# EAGLE design ardumashtun_opl_v1 (EAGLE 6.5.0)
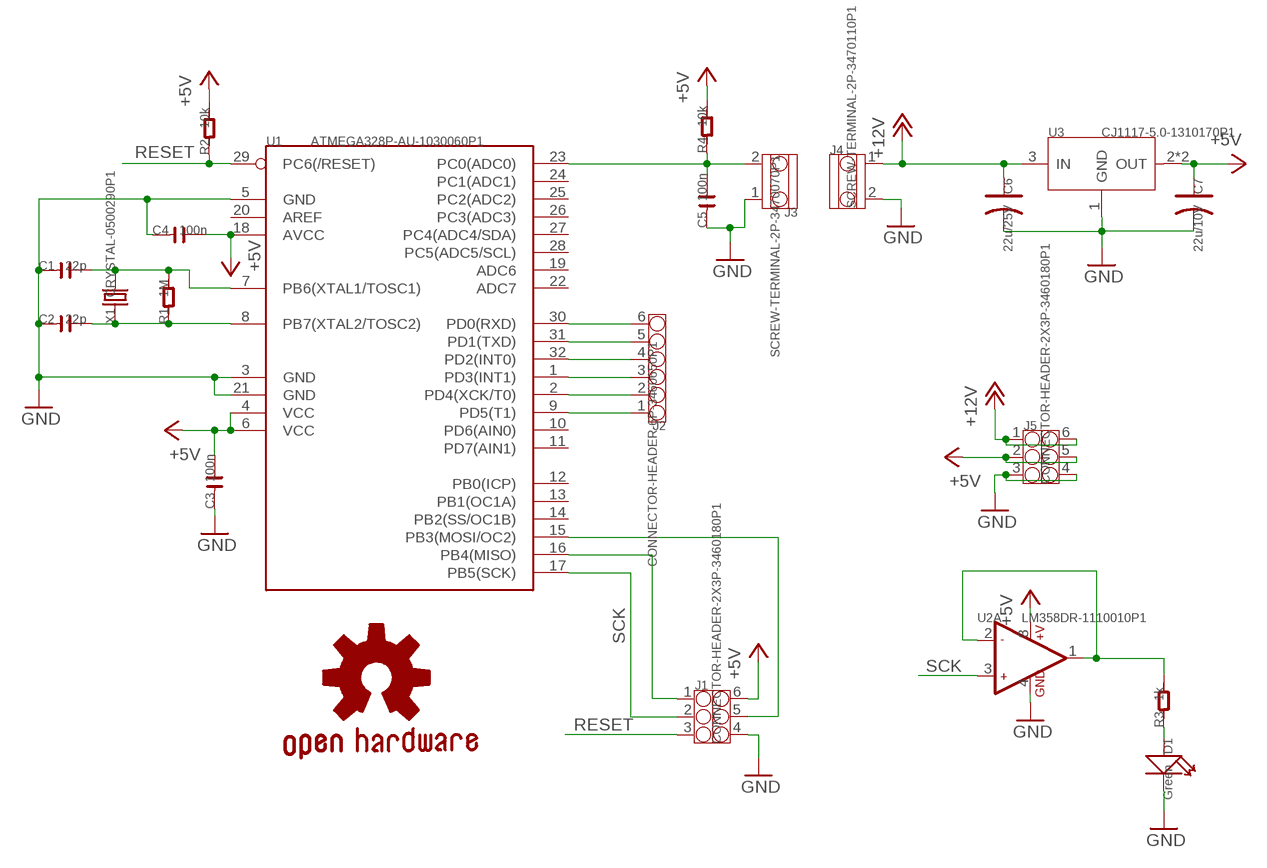
[diagram p0: schematic, sheet 1]

## Parts
C1  22p  C-0603  [C0603]
C2  22p  C-0603  [C0603]
C3  100n  C-0603  [C0603]
C4  100n  C-0603  [C0603]
C5  100n  C-0603  [C0603]
C6  22u/25V  C-POLAR-C  [AVX-C]
C7  22u/10V  C-POLAR-B  [AVX-B]
D1  Green  LED  [LED0603]
GOLD_ORB_SM1  OSHWLOGO_GOLD_ORB_SM  [OSHW2]
J1  CONNECTOR-HEADER-2X3P-3460180P1  [2X3P-2.54-2.54-11.6-3.0-BLACK-MALE]
J2  CONNECTOR-HEADER-6P-3460650P1  [1X6P-2.54-2.54-11.6-3.0-BLACK-MALE]
J3  SCREW-TERMINAL-2P-3470070P1  [2P-3.5]
J4  SCREW-TERMINAL-2P-3470110P1  [2P-5.0]
J5  CONNECTOR-HEADER-2X3P-3460180P1  [2X3P-2.54-2.54-11.6-3.0-BLACK-MALE]
R1  1M  R-0603  [R0603]
R2  10k  R-0603  [R0603]
R3  1k  R-0603  [R0603]
R4  10k  R-0603  [R0603]
U1  ATMEGA328P-AU-1030060P1  [TQFP32]
U2  LM358DR-1110010P1  [SOIC8]
U3  CJ1117-5.0-1310170P1  [SOT223]
X1  CRYSTAL-0500290P1  [2P-SMD-5.0X3.2]

## Nets
+5V: C3.2 C4.2 C7.+ J1.6 J5.2 J5.5 R2.2 R4.2 U1.4(VCC) U1.6(VCC) U1.18(AVCC) U2.8(A:+V) U3.2(OUT) U3.TER(OUT)
+12V: C6.+ J4.1 J5.1 J5.6 U3.3(IN)
GND: C1.1 C2.1 C3.1 C4.1 C5.1 C6.- C7.- D1.- J1.4 J3.1 J4.2 J5.3 J5.4 U1.3(GND) U1.5(GND) U1.21(GND) U2.4(A:GND) U3.1(GND)
N$1: C1.2 R1.2 U1.7(PB6(XTAL1/TOSC1)) X1.2
N$2: C2.2 R1.1 U1.8(PB7(XTAL2/TOSC2)) X1.1
N$3: R3.2 U2.1(A:OUT1) U2.2(A:-IN1)
N$5: J1.1 U1.16(PB4(MISO))
N$6: J1.5 U1.15(PB3(MOSI/OC2))
N$7: D1.+ R3.1
N$8: J2.6 U1.30(PD0(RXD))
N$9: J2.5 U1.31(PD1(TXD))
N$10: J2.4 U1.32(PD2(INT0))
N$11: J2.3 U1.1(PD3(INT1))
N$12: J2.2 U1.2(PD4(XCK/T0))
N$13: J2.1 U1.9(PD5(T1))
N$14: C5.2 J3.2 R4.1 U1.23(PC0(ADC0))
RESET: J1.3 R2.1 U1.29(PC6(/RESET))
SCK: J1.2 U1.17(PB5(SCK)) U2.3(A:+IN1)
Unconnected: U1.10(PD6(AIN0)) U1.11(PD7(AIN1)) U1.12(PB0(ICP)) U1.13(PB1(OC1A)) U1.14(PB2(SS/OC1B)) U1.19(ADC6) U1.20(AREF) U1.22(ADC7) U1.24(PC1(ADC1)) U1.25(PC2(ADC2)) U1.26(PC3(ADC3)) U1.27(PC4(ADC4/SDA)) U1.28(PC5(ADC5/SCL)) U2.5(B:+IN2) U2.6(B:-IN2) U2.7(B:OUT2)

## Library data of the parts
C1-C5 = OPL Eagle Library:C*
C6 C7 = OPL Eagle Library:C-POLAR*
D1 = OPL Eagle Library:LED*: LED
GOLD_ORB_SM1 = bfl:OSHWLOGO: These are Open-Source Hardware logos.
J1 J5 = OPL Eagle Library:CONNECTOR-HEADER-2X3P
J2 = OPL Eagle Library:CONNECTOR-HEADER-6P
J3 J4 = OPL Eagle Library:SCREW-TERMINAL-2P
R1-R4 = OPL Eagle Library:R*
U1 = OPL Eagle Library:ATMEGA328P-AU: 8-bit AVR Microcontroller with 32K Bytes In-System Programmable Flash
U2 = OPL Eagle Library:LM358DR: General purpose LOW Voltage, Rail-to-Rail Output Amplifiers http://www.fairchildsemi.com/ds/LM/LMV358.pdf
U3 = OPL Eagle Library:CJ1117-5.0
X1 = OPL Eagle Library:CRYSTAL*

## Board
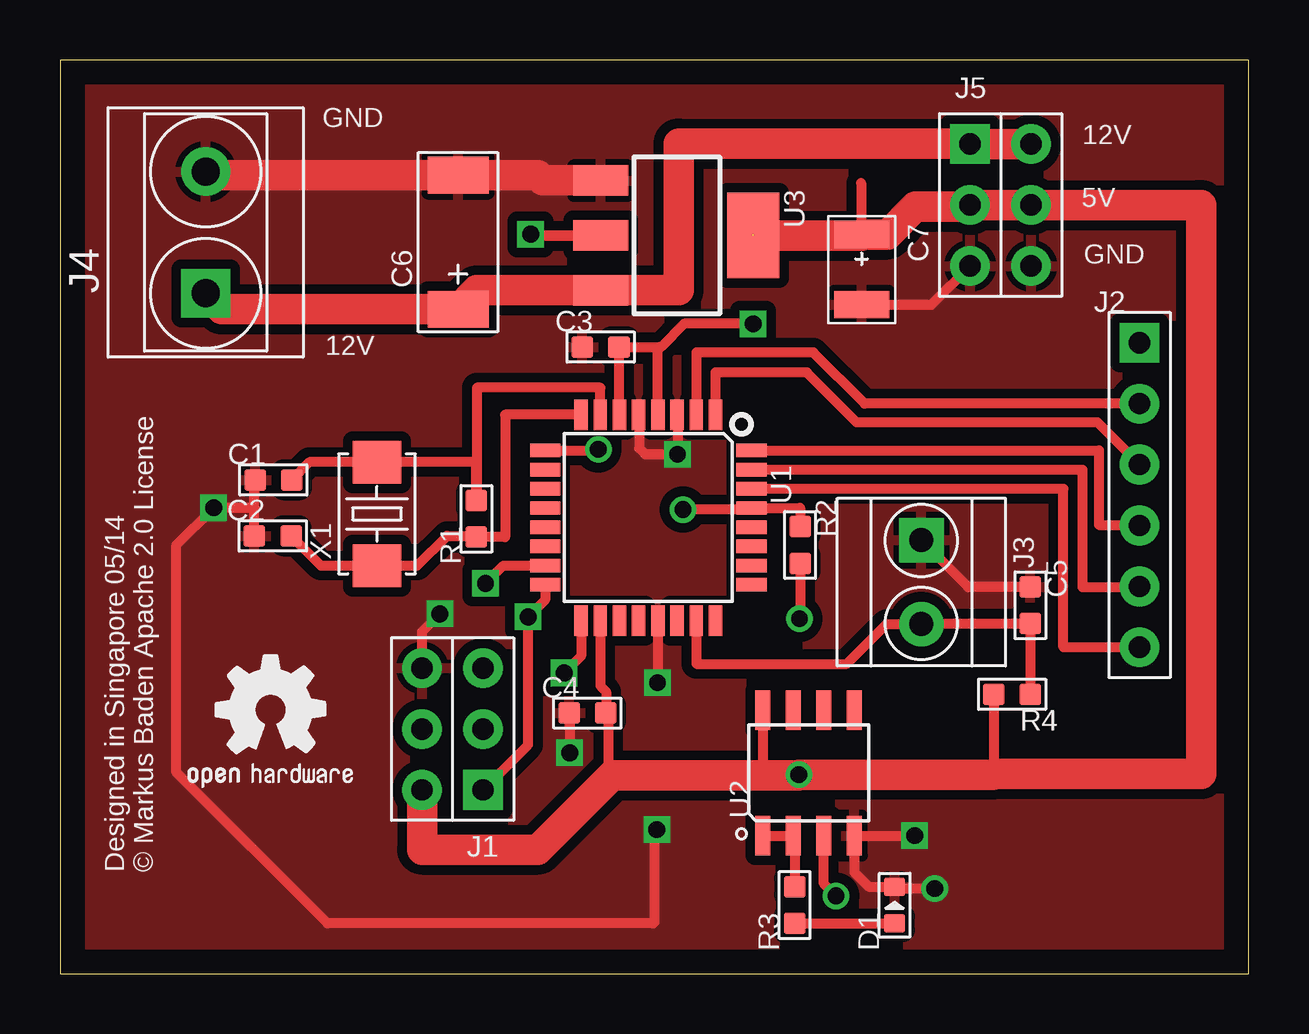
[diagram p1: board, top side]
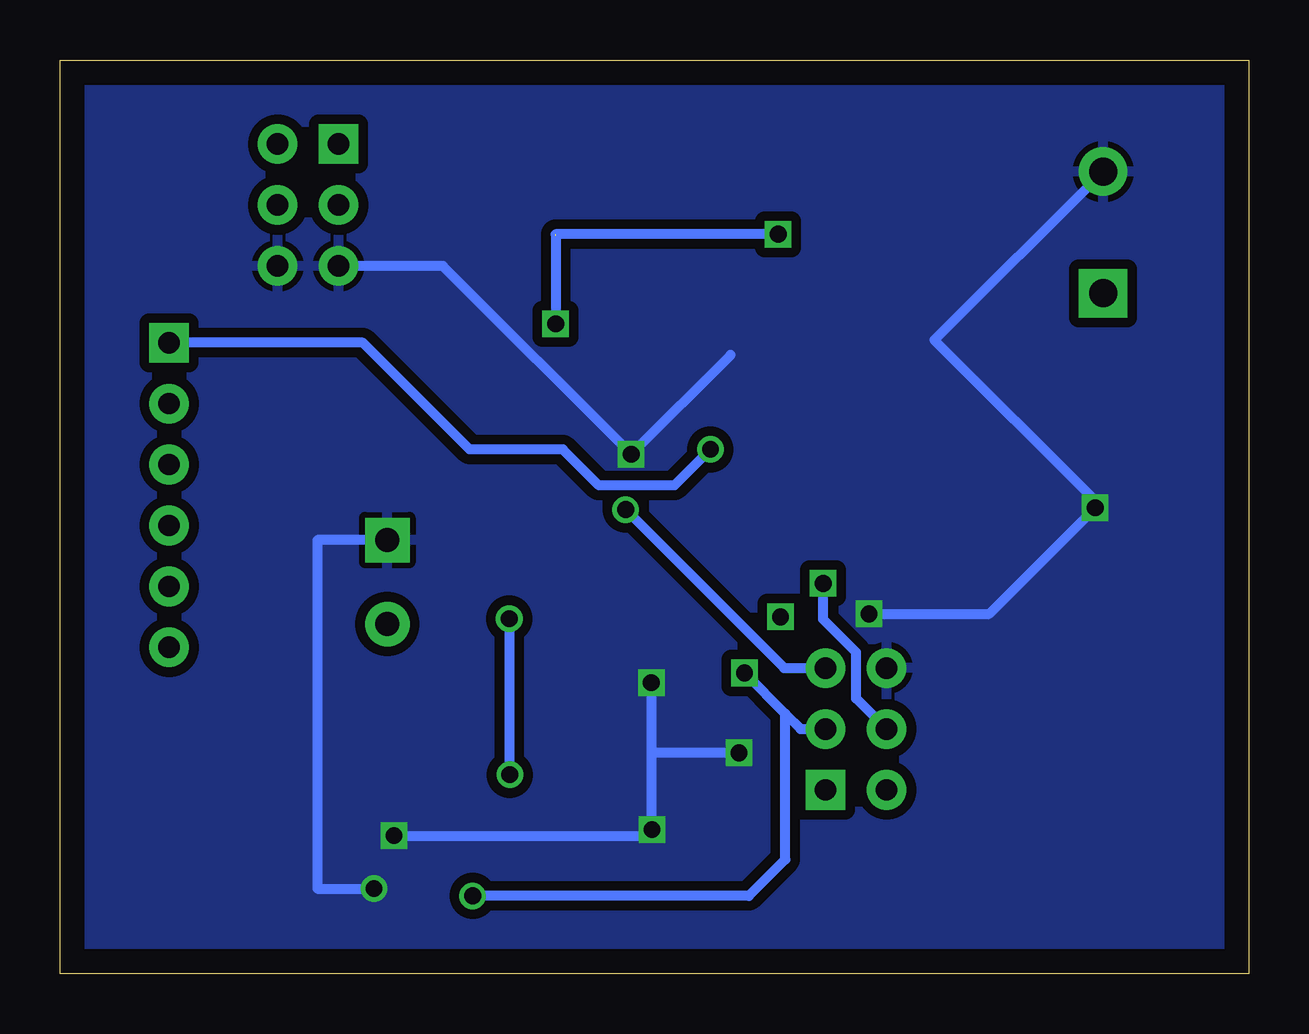
[diagram p2: board, bottom side, seen from below]

Size 49.53 x 38.1 mm. Coordinates in mm from the lower left corner, seen from the top.
Outline: 0,0 49.53,0 49.53,38.1 0,38.1 0,0
Copper layers (1*16): Top 0.035mm / dielectric 1.5mm / Bottom 0.035mm
Design rules "default": minimum track width 10mil, minimum drill 24mil, track to track 8mil, track to pad 8mil, pad to pad 8mil, via to via 8mil, smd to smd 8mil, copper to edge 40mil, drill to drill 8mil, minimum pad ring 10mil, minimum via ring 8mil, stop-mask expansion 4mil, vias tented up to drill 0mil, thermal gap 10mil

### Footprints (pad centres in the part's own frame; a part is rotated, then mirrored left to right if it is on the bottom)
C0603 = smd 0.889 x 0.889: 1 -0.762,0; 2 0.762,0
AVX-C = smd 1.524 x 2.54: + -2.794,0; - 2.794,0
AVX-B = smd 1.143 x 2.286: + -1.46,0; - 1.46,0
LED0603 = smd 0.762 x 0.889: + -0.762,0; - 0.762,0
2X3P-2.54-2.54-11.6-3.0-BLACK-MALE = drill 0.889 pad 1.651 square: 1 -1.27,2.54 | drill 0.889 pad 1.651: 2 -1.27,0; 3 -1.27,-2.54; 4 1.27,-2.54; 5 1.27,0; 6 1.27,2.54
1X6P-2.54-2.54-11.6-3.0-BLACK-MALE = drill 0.889 pad 1.651 square: 1 0,6.35 | drill 0.889 pad 1.651: 2 0,3.81; 3 0,1.27; 4 0,-1.27; 5 0,-3.81; 6 0,-6.35
2P-3.5 = drill 1 pad 1.85 square: 1 -1.75,0 | drill 1 pad 1.85: 2 1.75,0
2P-5.0 = drill 1.168 pad 2.032 square: 1 -2.54,0 | drill 1.168 pad 2.032: 2 2.54,0
R0603 = smd 0.889 x 0.889: 1 -0.762,0; 2 0.762,0
TQFP32 = smd 1.27 x 0.559: 1 -4.293,2.8; 2 -4.293,2; 3 -4.293,1.2; 4 -4.293,0.4; 5 -4.293,-0.4; 6 -4.293,-1.2; 7 -4.293,-2; 8 -4.293,-2.8; 17 4.293,-2.8; 18 4.293,-2; 19 4.293,-1.2; 20 4.293,-0.4; 21 4.293,0.4; 22 4.293,1.2; 23 4.293,2; 24 4.293,2.8 | smd 0.559 x 1.27: 9 -2.8,-4.293; 10 -2,-4.293; 11 -1.2,-4.293; 12 -0.4,-4.293; 13 0.4,-4.293; 14 1.2,-4.293; 15 2,-4.293; 16 2.8,-4.293; 25 2.8,4.293; 26 2,4.293; 27 1.2,4.293; 28 0.4,4.293; 29 -0.4,4.293; 30 -1.2,4.293; 31 -2,4.293; 32 -2.8,4.293
SOIC8 = smd 1.651 x 0.635: 1 -2.616,1.905; 2 -2.616,0.635; 3 -2.616,-0.635; 4 -2.616,-1.905; 5 2.616,-1.905; 6 2.616,-0.635; 7 2.616,0.635; 8 2.616,1.905
SOT223 = smd 1.27 x 2.286: 1 -2.286,-3.175; 2 0,-3.175; 3 2.286,-3.175 | smd 3.556 x 2.159: TER 0,3.175
2P-SMD-5.0X3.2 = smd 1.778 x 2.032: 1 -2.159,0; 2 2.159,0

### Placement (x,y rotation side)
C1  8.89,20.6 0 top
C2  8.86,18.26 0 top
C3  22.53,26.14 0 top
C4  21.97,10.87 0 top
C5  40.44,15.37 270 top
C6  16.59,30.51 90 top
C7  33.4,29.36 270 top
D1  34.77,2.87 90 top
GOLD_ORB_SM1  4.95,6.73 0 top
J1  16.36,10.21 180 top
J2  44.98,19.96 0 top
J3  35.89,16.33 270 top
J4  6.07,30.91 90 top
J5  39.19,32.05 0 top
R1  17.35,18.97 90 top
R2  30.84,17.88 270 top
R3  30.61,2.87 90 top
R4  39.67,11.66 180 top
U1  24.51,19.02 270 top
U2  31.19,8.38 90 top
U3  25.7,30.78 270 top
X1  13.21,19.18 90 top

### Tracks (layer width: path | path; a pad name or v marks a point on that pad's centre or on a via)
+5V  (via drill 0.7)  (1 unrouted)
  Top 0.406: U2.8 29.29,8.28 | R2.2 30.84,14.81 v30.81,14.81 | v30.79,8.31 30.79,8.28 | R4.2 38.91,8.33 38.96,8.33 | 23.16,8.28 22.84,8.61 22.84,10.87 C4.2 22.76,10.9 22.76,11.76 22.51,12.01 U1.18 | U1.6 23.31,26.12 C3.2 25.04,26.14 | 22.28,30.79 U3.2 23.01,30.79 arc-90 23.04,30.76 22.3,30.76 | 22.28,30.79 19.53,30.79 | 33.38,32.97 33.38,30.85 C7.+ | U1.4 24.91,26 arc-90 25.04,26.14 | 22.3,30.76 arc-90 22.28,30.79 | 22.3,30.76 19.61,30.76 v19.61,30.84 | v28.88,27.1 26.01,27.1 25.04,26.14
  Top 1.27: U3.TER 33.4,30.79 C7.+ 34.48,30.82 35.64,31.98 37.85,31.98 J5.2 J5.5 47.45,32.05 47.55,31.95 | 47.55,31.95 47.55,8.33 38.96,8.33 38.86,8.31 v30.79,8.31 | 47.55,31.95 47.55,32.05 | 30.79,8.28 29.29,8.28 23.16,8.28 23.01,8.28 19.91,5.18 15.09,5.18 J1.6
  Bottom 0.406: v30.81,14.81 30.81,8.31 v30.79,8.31 | v19.61,30.84 28.88,30.84 v28.88,27.1
+12V
  Top 1.27: J4.1 6.73,27.71 C6.+ 17.37,28.5 U3.3 25.78,28.5 25.78,34.62 37.92,34.62 J5.1 J5.6
GND  (via drill 0.7)
  Top 0.406: C5.1 37.84,16.13 J3.1 | v36.45,3.56 34.77,3.56 D1.- 33.71,3.63 33.1,4.24 U2.4 v35.61,5.77 | C7.- 36.31,27.9 J5.3 | C1.1 8.1,20.57 C2.1 8.1,19.43 v6.4,19.43 4.85,17.88 4.85,8.41 11.15,2.11 24.71,2.11 24.77,2.16 24.77,5.97 24.82,6.02 v24.87,6.02 | U1.21 24.91,12.16 v24.89,12.14 | J1.4 15.09,14.28 v15.82,15.01 | C4.1 21.23,10.85 v21.23,9.22 | U1.5 24.13,23.3 24.13,21.92 24.38,21.67 v25.73,21.67 25.73,23.3 U1.3
  Top 1.27: J4.2 6.22,33.3 C6.- 19.91,33.3 20.12,33.1 22.5,33.1 U3.1
  Bottom 0.406: J3.1 38.81,18.08 38.81,3.56 v36.45,3.56 | J4.2 13.09,26.43 6.4,19.74 v6.4,19.43 10.82,15.01 v15.82,15.01 | v24.89,12.14 24.89,9.22 | 24.89,9.22 24.89,6.04 v24.87,6.02 25.12,5.77 v35.61,5.77 | v21.23,9.22 24.89,9.22 | J5.3 33.58,29.52 v25.73,21.67 21.59,25.81
  pour Bottom (isolate 0.406): 0.1,38.05 49.53,38.05 49.53,0.08 0.03,0.08 0.03,38.05
  pour Top (isolate 0.406): 0,38.13 49.53,38.13 49.53,0.05 0,0.05
N$1
  Top 0.406: U1.7 22.51,24.43 17.37,24.43 17.37,19.74 R1.2 17.35,21.34 X1.2 10.39,21.34 C1.2
N$2
  Top 0.406: U1.8 18.54,23.32 18.54,18.21 R1.1 17.3,18.26 16.13,18.26 14.88,17.02 X1.1 10.87,17.02 C2.2
N$3
  Top 0.406: R3.2 30.61,5.71 U2.2 U2.1
N$5  (via drill 0.7)
  Top 0.406: U1.16 20.22,15.6 v19.51,14.88 19.51,9.55 J1.1
N$6  (via drill 0.7)
  Top 0.406: 20.2,17.04 U1.15 18.47,17.02 v17.73,16.28
  Bottom 0.406: J1.5 16.36,11.48 16.36,13.41 17.73,14.78 v17.73,16.28
N$7
  Top 0.406: R3.1 D1.+
N$8
  Top 0.406: J2.6 41.81,13.61 41.81,20.23 U1.30
N$9
  Top 0.406: U1.31 42.6,21.02 42.6,16.13 44.98,16.13 J2.5
N$10
  Top 0.406: U1.32 43.28,21.82 43.28,18.72 44.98,18.72 J2.4
N$11
  Top 0.406: J2.3 43.23,22.99 33.2,22.99 31.11,25.07 27.31,25.07 U1.1
N$12
  Top 0.406: J2.2 33.53,23.77 31.39,25.91 26.51,25.91 U1.2
N$13  (via drill 0.7)
  Top 0.406: U1.9 22.43,21.82
  Top 0.61: 22.43,21.82 v22.43,21.87
  Bottom 0.406: J2.1 36.91,26.31 32.46,21.87 28.57,21.87 27.08,20.37 23.93,20.37 v22.43,21.87
N$14
  Top 0.406: U1.23 26.51,12.93 32.79,12.93 34.45,14.58 J3.2 35.91,14.61 C5.2 R4.1
RESET  (via drill 0.7)
  Top 0.406: R2.1 30.84,19.43 U1.29 28.73,19.36 v25.96,19.36
  Bottom 0.406: v25.96,19.36 19.36,12.75 J1.3
SCK  (via drill 0.7)
  Top 0.406: v32.33,3.25 31.83,3.76 U2.3 | U1.17 21.71,13.25 v21.01,12.55
  Bottom 0.406: v32.33,3.25 20.83,3.25 19.3,4.78 19.3,10.85 | v21.01,12.55 19.3,10.85 | 19.3,10.85 18.67,10.21 J1.2

### Text on the board
tNames: GND | 12V | 5V | GND | 12V | Designed in Singapore 05/14 / © Markus Baden Apache 2.0 License